# Altium schematic sheet Dust1_Motherboard_BTB.SchDoc
size A4; SheetNumber: 4; SheetTotal: 5
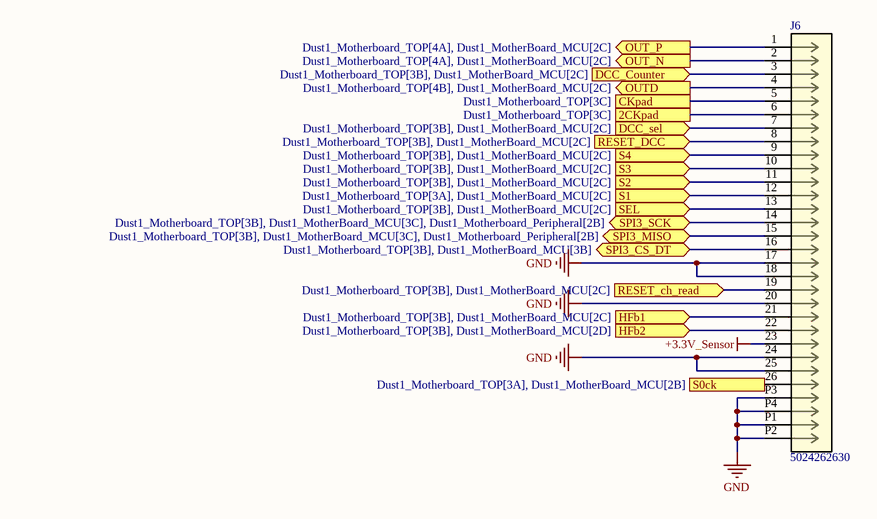
[diagram p0: Dust1_Motherboard_BTB.SchDoc]

## Parts
J6  5024262630  [CON_5024262630_MOL]

## Ports
2CKpad (see Dust1_Motherboard_TOP[3C]), CKpad (see Dust1_Motherboard_TOP[3C]), DCC_Counter (in, see Dust1_Motherboard_TOP[3B], Dust1_MotherBoard_MCU[2C]), DCC_sel (in, see Dust1_Motherboard_TOP[3B], Dust1_MotherBoard_MCU[2C]), HFb1 (in, see Dust1_Motherboard_TOP[3B], Dust1_MotherBoard_MCU[2C]), HFb2 (in, see Dust1_Motherboard_TOP[3B], Dust1_MotherBoard_MCU[2D]), OUT_N (out, see Dust1_Motherboard_TOP[4A], Dust1_MotherBoard_MCU[2C]), OUT_P (out, see Dust1_Motherboard_TOP[4A], Dust1_MotherBoard_MCU[2C]), OUTD (out, see Dust1_Motherboard_TOP[4B], Dust1_MotherBoard_MCU[2C]), RESET_ch_read (in, see Dust1_Motherboard_TOP[3B], Dust1_MotherBoard_MCU[2C]), RESET_DCC (in, see Dust1_Motherboard_TOP[3B], Dust1_MotherBoard_MCU[2C]), S0ck (in, see Dust1_Motherboard_TOP[3A], Dust1_MotherBoard_MCU[2B]), S1 (in, see Dust1_Motherboard_TOP[3A], Dust1_MotherBoard_MCU[2C]), S2 (in, see Dust1_Motherboard_TOP[3B], Dust1_MotherBoard_MCU[2C]), S3 (in, see Dust1_Motherboard_TOP[3B], Dust1_MotherBoard_MCU[2C]), S4 (in, see Dust1_Motherboard_TOP[3B], Dust1_MotherBoard_MCU[2C]), SEL (in, see Dust1_Motherboard_TOP[3B], Dust1_MotherBoard_MCU[2C]), SPI3_CS_DT (bidir, see Dust1_Motherboard_TOP[3B], Dust1_MotherBoard_MCU[3B]), SPI3_MISO (bidir, see Dust1_Motherboard_TOP[3B], Dust1_MotherBoard_MCU[3C], Dust1_Motherboard_Peripheral[2B]), SPI3_SCK (bidir, see Dust1_Motherboard_TOP[3B], Dust1_MotherBoard_MCU[3C], Dust1_Motherboard_Peripheral[2B])

## Nets
+3.3V_Sensor: J6.23
GND: J6.17 J6.18 J6.20 J6.24 J6.25 J6.P1 J6.P2 J6.P3 J6.P4
2CKpad: J6.6 ; port 2CKpad
CKpad: J6.5 ; port CKpad
DCC_Counter: J6.3 ; port DCC_Counter
DCC_sel: J6.7 ; port DCC_sel
HFb1: J6.21 ; port HFb1
HFb2: J6.22 ; port HFb2
OUT_N: J6.2 ; port OUT_N
OUT_P: J6.1 ; port OUT_P
OUTD: J6.4 ; port OUTD
RESET_ch_read: J6.19 ; port RESET_ch_read
RESET_DCC: J6.8 ; port RESET_DCC
S0ck: J6.26 ; port S0ck
S1: J6.12 ; port S1
S2: J6.11 ; port S2
S3: J6.10 ; port S3
S4: J6.9 ; port S4
SEL: J6.13 ; port SEL
SPI3_CS_DT: J6.16 ; port SPI3_CS_DT
SPI3_MISO: J6.15 ; port SPI3_MISO
SPI3_SCK: J6.14 ; port SPI3_SCK

## Library data of the parts
J6 = CMP-125-000000-4: SlimStack Board-to-Board Receptacle, 0.40mm Pitch, Surface Mount, Dual Row, Vertical, 1.00mm Stacking Height, with Solder Tabs, with Vacuum Tape, 26 Circuits; Manufacturer_Name: Molex Connector Corporation; RefDes: RefDes; Copyright: Copyright (C) 2025 Ultra Librarian. All rights reserved.; Manufacturer_Part_Number: 5024262630; Design Item ID: 5024262630; Source: 5024262630.SchLib; Type: Type